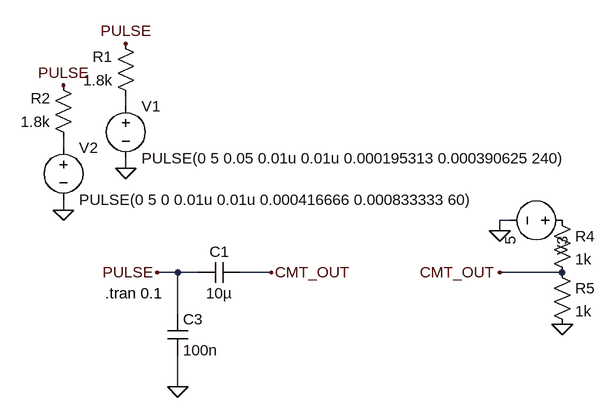
[diagram p0: schematic interface-line-out.asc]
interface-line-out.asc, the LTspice schematic file:
Version 4
SHEET 1 1840 680
WIRE 176 -432 176 -448
WIRE 80 -368 80 -384
WIRE 176 -336 176 -352
WIRE 80 -272 80 -288
WIRE 768 -256 752 -256
WIRE 752 -240 752 -256
WIRE 256 -176 224 -176
WIRE 288 -176 256 -176
WIRE 400 -176 352 -176
WIRE 848 -176 752 -176
WIRE 256 -112 256 -176
WIRE 256 0 256 -48
FLAG 176 -336 0
FLAG 256 0 0
FLAG 80 -272 0
FLAG 176 -528 PULSE
FLAG 80 -464 PULSE
FLAG 224 -176 PULSE
FLAG 400 -176 CMT_OUT
FLAG 848 -96 0
FLAG 752 -176 CMT_OUT
FLAG 752 -240 0
SYMBOL voltage 176 -448 R0
WINDOW 123 0 0 Left 2
WINDOW 39 0 0 Left 2
SYMATTR InstName V1
SYMATTR Value PULSE(0 5 0.05 0.01u 0.01u 0.000195313 0.000390625 240)
SYMBOL res 192 -432 R180
WINDOW 0 36 76 Left 2
WINDOW 3 36 40 Left 2
SYMATTR InstName R1
SYMATTR Value 1.8k
SYMBOL cap 352 -192 R90
WINDOW 0 0 32 VBottom 2
WINDOW 3 32 32 VTop 2
SYMATTR InstName C1
SYMATTR Value 10µ
SYMBOL cap 240 -112 R0
SYMATTR InstName C3
SYMATTR Value 100n
SYMBOL voltage 80 -384 R0
WINDOW 123 0 0 Left 2
WINDOW 39 0 0 Left 2
SYMATTR InstName V2
SYMATTR Value PULSE(0 5 0 0.01u 0.01u 0.000416666 0.000833333 60)
SYMBOL res 96 -368 R180
WINDOW 0 36 76 Left 2
WINDOW 3 36 40 Left 2
SYMATTR InstName R2
SYMATTR Value 1.8k
SYMBOL voltage 864 -256 R90
WINDOW 123 0 0 Left 2
WINDOW 39 0 0 Left 2
SYMATTR InstName V3
SYMATTR Value 5
SYMBOL res 832 -272 R0
SYMATTR InstName R4
SYMATTR Value 1k
SYMBOL res 832 -192 R0
SYMATTR InstName R5
SYMATTR Value 1k
TEXT 144 -144 Left 2 !.tran 0.1

The netlist it stands for:
* interface-line-out.asc
V1 N001 0 PULSE(0 5 0.05 0.01u 0.01u 0.000195313 0.000390625 240)
R1 N001 PULSE 1.8k
C1 CMT_OUT PULSE 10µ
C3 PULSE 0 100n
V2 N002 0 PULSE(0 5 0 0.01u 0.01u 0.000416666 0.000833333 60)
R2 N002 PULSE 1.8k
V3 P001 0 5
R4 P001 CMT_OUT 1k
R5 CMT_OUT 0 1k
.tran 0.1
.backanno
.end